# Altium schematic sheet Global Params.SchDoc: Global Parameters
size A; DocumentNumber: 1; SheetNumber: 1; SheetTotal: 1
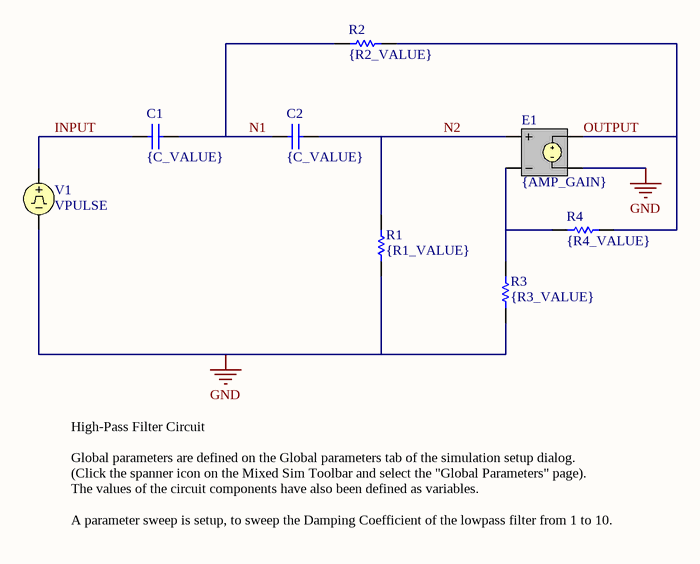
[diagram p0: Global Params.SchDoc]

## Parts
C1  value {C_VALUE}  [RAD-0.3]  (hidden comment: Cap)
C2  value {C_VALUE}  [RAD-0.3]  (hidden comment: Cap)
E1  Gain: {AMP_GAIN}  (hidden comment: ESRC)
R1  value {R1_VALUE}  [AXIAL-0.3]  (hidden comment: Res1)
R2  value {R2_VALUE}  [AXIAL-0.3]  (hidden comment: Res1)
R3  value {R3_VALUE}  [AXIAL-0.3]  (hidden comment: Res1)
R4  value {R4_VALUE}  [AXIAL-0.3]  (hidden comment: Res1)
V1  VPULSE

## Nets
GND: E1.4(N-) R1.1 R3.1 V1.2
INPUT: C1.1 V1.1
N1: C1.2 C2.2 R2.2
N2: C2.1 E1.1(NC+) R1.2
OUTPUT: E1.3(N+) R2.1 R4.1
NetE1_2: E1.2(NC-) R3.2 R4.2

## Notes on the sheet
- High-Pass Filter Circuit
  Global parameters are defined on the Global parameters tab of the simulation setup dialog.
  (Click the spanner icon on the Mixed Sim Toolbar and select the "Global Parameters" page).
  The values of the circuit components have also been defined as variables.
  A parameter sweep is setup, to sweep the Damping Coefficient of the lowpass filter from 1 to 10.
- Title
- Size:
- Date:
- A
- Number:
- Time:
- Revision:
- Sheet
- of
- File:

## Library data of the parts
C1 C2 = Cap: Capacitor; Published: 8-Jun-2000; LatestRevisionDate: 17-Jul-2002; LatestRevisionNote: Re-released for DXP Platform.; Publisher: Altium Limited
E1 = ESRC: Voltage Controlled Voltage Source; Note: PCB Footprint - Not required; Sim Note: Enter gain into gain field; Published: 8-Jun-2000; LatestRevisionDate: 17-Jul-2002; LatestRevisionNote: Re-released for DXP Platform.; PackageReference: Not Applicable; Publisher: Altium Limited
R1-R4 = Res1: Resistor; Published: 8-Jun-2000; LatestRevisionDate: 17-Jul-2002; LatestRevisionNote: Re-released for DXP Platform.; Publisher: Altium Limited
V1 = VPULSE: Pulse Voltage Source; Note: PCB Footprint - Not required; Published: 8-Jun-2000; LatestRevisionDate: 15-Nov-2004; LatestRevisionNote: Corrected Netlist.; PackageReference: Not Applicable; Publisher: Altium Limited